# EAGLE design NeoPixel Stick (EAGLE 9.0.1)
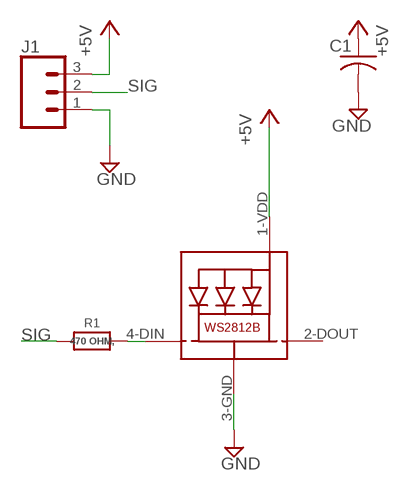
[diagram p0: schematic, sheet 1]

## Parts
C1  C-USC0805K  [C0805K]
J1  CONN_03LONGPADS  [1X03_LONGPADS]
LED1  WS2812B5050  [WS2812B]
R1  470 OHM,  RESISTOR_0805MP  [_0805MP]

## Nets
+5V: C1.1 J1.3 LED1.1-VDD(VDD)
GND: C1.2 J1.1 LED1.3-GND(GND)
N$10: LED1.4-DIN(DI) R1.2
SIG: J1.2 R1.1
Unconnected: LED1.2-DOUT(DO)

## Library data of the parts
C1 = rcl:C-US: CAPACITOR, American symbol
J1 = SparkFun-Connectors:CONN_03: Multi connection point. Often used as Generic Header-pin footprint for 0.1 inch spaced/style header connections On any of the 0.1 inch spaced packages, you can populate with these: Break Away Headers - Straight <https://www.sparkfun.com/products/116> (PRT-00116) Break Away Male Headers - Right Angle <https://www.sparkfun.com/products/553> (PRT-00553) Female Headers <https://www.sparkfun.com/products/115> (PRT-00115) Break Away Headers - Machine Pin <https://www.sparkfun.com/products/117> (PRT-00117) Break Away Female Headers - Swiss Machine Pin <https://www.sparkfun.com/products/743> (PRT-00743) Stackable Header - 3 Pin (Female, 0.1") <https://www.sparkfun.com/products/13875> (PRT-13875) For SCREWTERMINALS and SPRING TERMINALS visit here: Screw Terimnals on SparkFun.com <https://www.sparkfun.com/search/results?term=Screw+Terminals> (5mm/3.5mm/2.54mm spacing) This device is also useful as a general connection point to wire up your design to another part of your project. Our various solder wires solder well into these plated through hole pads. Hook-Up Wire - Assortment (Stranded, 22 AWG) <https://www.sparkfun.com/products/11375> (PRT-11375) Hook-Up Wire - Assortment (Solid Core, 22 AWG) <https://www.sparkfun.com/products/11367> (PRT-11367) View the entire wire category on our website here <https://www.sparkfun.com/categories/141> Special notes: Molex polarized connector foot print use with SKU : PRT-08232 with associated crimp pins and housings.
LED1 = microbuilder:WS2812B5050
R1 = microbuilder:RESISTOR: Resistors For new designs, use the packages preceded by an '_' character since they are more reliable: The following footprints should be used on most boards: _0402 - Standard footprint for regular board layouts _0603 - Standard footprint for regular board layouts _0805 - Standard footprint for regular board layouts _1206 - Standard footprint for regular board layouts For extremely tight-pitch boards where space is at a premium, the following 'micro-pitch' footprints can be used (smaller pads, no silkscreen outline, etc.): _0402MP - Micro-pitch footprint for very dense/compact boards _0603MP - Micro-pitch footprint for very dense/compact boards _0805MP - Micro-pitch footprint for very dense/compact boards _1206MP - Micro-pitch footprint for very dense/compact boards

## Net classes
0 default: width 0.406 mm

## Board
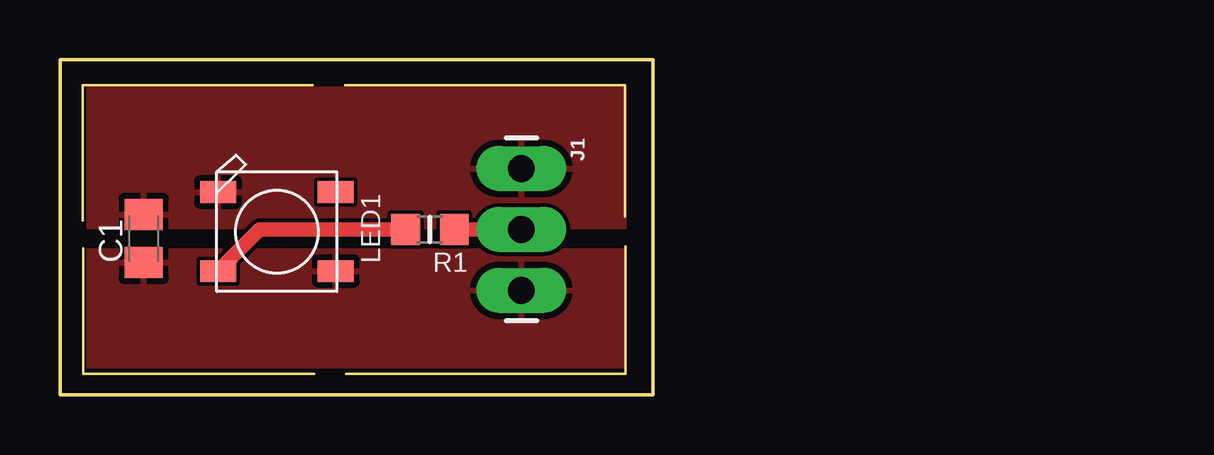
[diagram p1: board, top side]
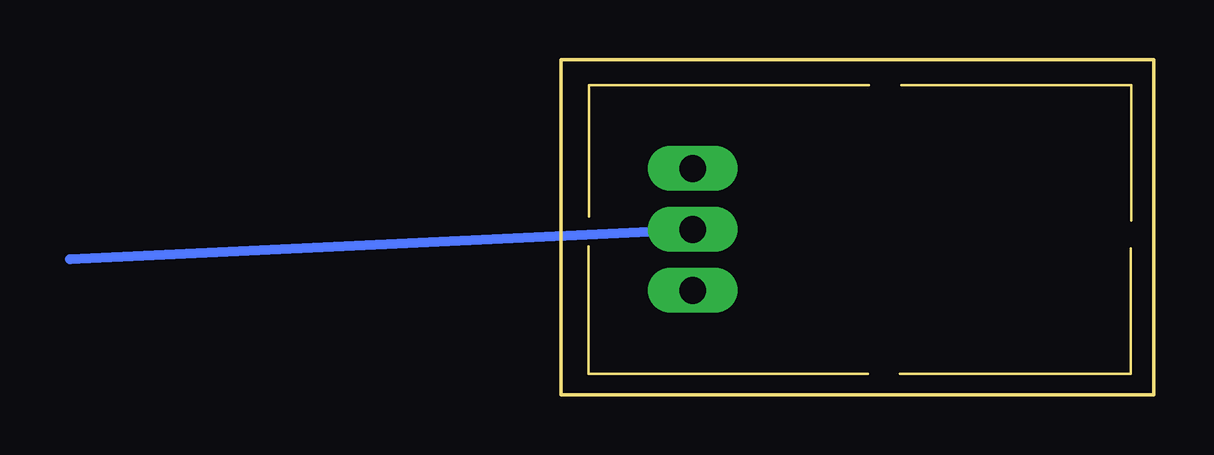
[diagram p2: board, bottom side, seen from below]

Size 24.71 x 13.97 mm. Coordinates in mm from the lower left corner, seen from the top.
Outline: 0,0 24.71,0.01 24.71,13.97 0,13.97 0,0
Copper layers (1*16): Top 0.035mm / dielectric 1.5mm / Bottom 0.035mm
Design rules "default *": minimum track width 16mil, minimum drill 0.35mm, track to track 6mil, track to pad 6mil, pad to pad 6mil, via to via 6mil, smd to smd 6mil, copper to edge 40mil, drill to drill 6mil, minimum pad ring 10mil, minimum via ring 8mil, stop-mask expansion 4mil, vias tented up to drill 0mil, thermal gap 10mil
Milling: 8 lines

### Footprints (pad centres in the part's own frame; a part is rotated, then mirrored left to right if it is on the bottom)
C0805K = smd 1.3 x 1.6: 1 -1,0; 2 1,0
1X03_LONGPADS = drill 1.118 pad 1.88 long: 1 0,0; 2 2.54,0; 3 5.08,0
WS2812B = smd 1.5 x 0.9: 1-VDD 2.45,-1.65; 2-DOUT 2.45,1.65; 3-GND -2.45,1.65; 4-DIN -2.45,-1.65
_0805MP = smd 1.2 x 1.3: 1 -1.016,0; 2 1.016,0

### Placement (x,y rotation side)
C1  3.49,6.52 90 top
J1  19.23,9.44 270 top
LED1  9.04,6.81 0 top
R1  15.42,6.9 180 top

### Tracks (layer width: path | path; a pad name or v marks a point on that pad's centre or on a via)
+5V
  pour Top: 0.88,6.04 23.44,6.04 23.44,0.77 0.87,0.77 0.87,6.04 0.86,6.04 0.86,6.06
GND
  pour Top: 0.83,6.99 23.57,6.99 23.57,12.91 0.92,12.91 0.92,12.82
N$10
  Top 0.406: 14.33,6.7 R1.2
  Top 0.61: R1.2 8.33,6.9 LED1.4-DIN
SIG
  Top 0.61: J1.2 R1.1
  Bottom 0.406: 45.2,5.67 J1.2